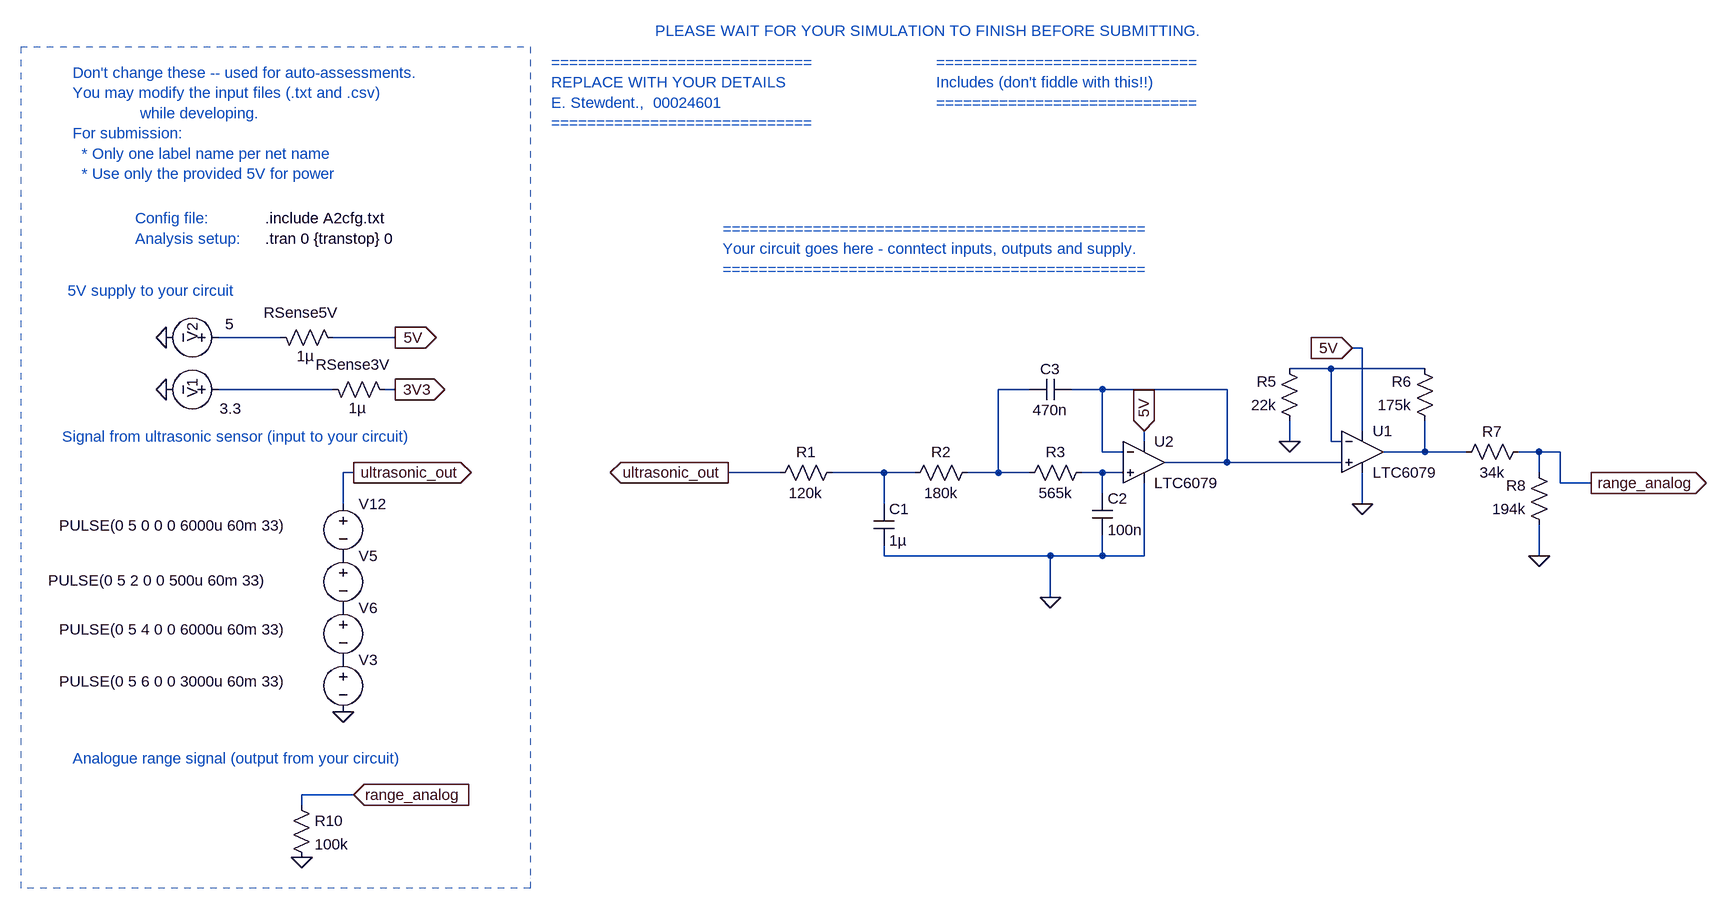
[diagram p0: schematic E344_Ass2_US2A.asc]
E344_Ass2_US2A.asc, the LTspice schematic file:
Version 4
SHEET 1 3140 2124
WIRE -1968 -976 -2064 -976
WIRE -1792 -976 -1888 -976
WIRE -304 -960 -320 -960
WIRE -352 -928 -416 -928
WIRE -208 -928 -352 -928
WIRE -1888 -896 -2064 -896
WIRE -1792 -896 -1808 -896
WIRE -816 -896 -864 -896
WIRE -704 -896 -752 -896
WIRE -512 -896 -704 -896
WIRE -304 -832 -304 -960
WIRE -640 -816 -640 -832
WIRE -416 -816 -416 -848
WIRE -352 -816 -352 -928
WIRE -336 -816 -352 -816
WIRE -704 -800 -704 -896
WIRE -672 -800 -704 -800
WIRE -208 -800 -208 -848
WIRE -208 -800 -272 -800
WIRE -144 -800 -208 -800
WIRE -32 -800 -64 -800
WIRE 0 -800 -32 -800
WIRE -512 -784 -512 -896
WIRE -512 -784 -608 -784
WIRE -336 -784 -512 -784
WIRE -1856 -768 -1872 -768
WIRE -1200 -768 -1280 -768
WIRE -1040 -768 -1120 -768
WIRE -992 -768 -1040 -768
WIRE -864 -768 -864 -896
WIRE -864 -768 -912 -768
WIRE -816 -768 -864 -768
WIRE -704 -768 -736 -768
WIRE -672 -768 -704 -768
WIRE -32 -768 -32 -800
WIRE 0 -752 0 -800
WIRE 48 -752 0 -752
WIRE -704 -736 -704 -768
WIRE -1872 -720 -1872 -768
WIRE -1040 -720 -1040 -768
WIRE -304 -720 -304 -768
WIRE -1040 -640 -1040 -656
WIRE -784 -640 -1040 -640
WIRE -704 -640 -704 -672
WIRE -704 -640 -784 -640
WIRE -640 -640 -640 -752
WIRE -640 -640 -704 -640
WIRE -32 -640 -32 -688
WIRE -784 -576 -784 -640
WIRE -1856 -272 -1936 -272
WIRE -1936 -256 -1936 -272
FLAG -1792 -976 5V
IOPIN -1792 -976 Out
FLAG -2144 -976 0
FLAG -1872 -400 0
FLAG -1856 -768 ultrasonic_out
IOPIN -1856 -768 Out
FLAG -1280 -768 ultrasonic_out
IOPIN -1280 -768 Out
FLAG 48 -752 range_analog
IOPIN 48 -752 Out
FLAG -1856 -272 range_analog
IOPIN -1856 -272 In
FLAG -1936 -176 0
FLAG -1792 -896 3V3
IOPIN -1792 -896 Out
FLAG -2144 -896 0
FLAG -320 -960 5V
IOPIN -320 -960 In
FLAG -416 -816 0
FLAG -784 -576 0
FLAG -640 -832 5V
IOPIN -640 -832 In
FLAG -304 -720 0
FLAG -32 -640 0
SYMBOL voltage -2048 -976 R90
WINDOW 123 0 0 Left 0
WINDOW 39 0 0 Left 0
WINDOW 0 -23 56 Left 2
WINDOW 3 -21 -8 VRight 2
SYMATTR InstName V2
SYMATTR Value 5
SYMBOL res -1984 -992 M90
WINDOW 0 -7 47 VBottom 2
WINDOW 3 29 54 VTop 2
SYMATTR InstName RSense5V
SYMATTR Value 1µ
SYMBOL voltage -1872 -736 R0
WINDOW 123 0 0 Left 0
WINDOW 39 0 0 Left 0
WINDOW 3 -437 49 Left 2
SYMATTR Value PULSE(0 5 0 0 0 6000u 60m 33)
SYMATTR InstName V12
SYMBOL voltage -1872 -656 R0
WINDOW 123 0 0 Left 0
WINDOW 39 0 0 Left 0
WINDOW 3 -454 54 Left 2
SYMATTR Value PULSE(0 5 2 0 0 500u 60m 33)
SYMATTR InstName V5
SYMBOL voltage -1872 -576 R0
WINDOW 123 0 0 Left 0
WINDOW 39 0 0 Left 0
WINDOW 3 -437 49 Left 2
SYMATTR Value PULSE(0 5 4 0 0 6000u 60m 33)
SYMATTR InstName V6
SYMBOL voltage -1872 -496 R0
WINDOW 123 0 0 Left 0
WINDOW 39 0 0 Left 0
WINDOW 3 -437 49 Left 2
SYMATTR Value PULSE(0 5 6 0 0 3000u 60m 33)
SYMATTR InstName V3
SYMBOL res -1952 -272 R0
SYMATTR InstName R10
SYMATTR Value 100k
SYMBOL voltage -2048 -896 R90
WINDOW 123 0 0 Left 0
WINDOW 39 0 0 Left 0
WINDOW 0 -17 56 Left 2
WINDOW 3 29 -20 VRight 2
SYMATTR InstName V1
SYMATTR Value 3.3
SYMBOL res -1904 -912 M90
WINDOW 0 -7 47 VBottom 2
WINDOW 3 29 54 VTop 2
SYMATTR InstName RSense3V
SYMATTR Value 1µ
SYMBOL Opamps\\LTC6079 -304 -800 R0
SYMATTR InstName U1
SYMBOL res -192 -832 R180
WINDOW 0 36 76 Left 2
WINDOW 3 36 40 Left 2
SYMATTR InstName R6
SYMATTR Value 175k
SYMBOL res -400 -832 R180
WINDOW 0 36 76 Left 2
WINDOW 3 36 40 Left 2
SYMATTR InstName R5
SYMATTR Value 22k
SYMBOL Opamps\\LTC6079 -640 -784 R0
SYMATTR InstName U2
SYMBOL res -1104 -784 R90
WINDOW 0 0 56 VBottom 2
WINDOW 3 32 56 VTop 2
SYMATTR InstName R1
SYMATTR Value 120k
SYMBOL res -896 -784 R90
WINDOW 0 0 56 VBottom 2
WINDOW 3 32 56 VTop 2
SYMATTR InstName R2
SYMATTR Value 180k
SYMBOL res -720 -784 R90
WINDOW 0 0 56 VBottom 2
WINDOW 3 32 56 VTop 2
SYMATTR InstName R3
SYMATTR Value 565k
SYMBOL cap -1056 -720 R0
SYMATTR InstName C1
SYMATTR Value 1µ
SYMBOL cap -720 -736 R0
SYMATTR InstName C2
SYMATTR Value 100n
SYMBOL cap -752 -912 R90
WINDOW 0 0 32 VBottom 2
WINDOW 3 32 32 VTop 2
SYMATTR InstName C3
SYMATTR Value 470n
SYMBOL res -48 -816 R90
WINDOW 0 0 56 VBottom 2
WINDOW 3 32 56 VTop 2
SYMATTR InstName R7
SYMATTR Value 34k
SYMBOL res -16 -672 R180
WINDOW 0 36 76 Left 2
WINDOW 3 36 40 Left 2
SYMATTR InstName R8
SYMATTR Value 194k
TEXT -1992 -1128 Left 2 !.tran 0 {transtop} 0
TEXT -1992 -1160 Left 2 !.include A2cfg.txt
TEXT -2288 -1384 Left 2 ;Don't change these -- used for auto-assessments.\nYou may modify the input files (.txt and .csv) \n               while developing.\nFor submission: \n  * Only one label name per net name\n  * Use only the provided 5V for power
TEXT -2192 -1160 Left 2 ;Config file:
TEXT -2192 -1128 Left 2 ;Analysis setup:
TEXT -1552 -1400 Left 2 ;=============================\nREPLACE WITH YOUR DETAILS\nE. Stewdent.,  00024601\n=============================
TEXT -960 -1400 Left 2 ;=============================\nIncludes (don't fiddle with this!!)\n=============================
TEXT -1288 -1144 Left 2 ;===============================================\nYour circuit goes here - conntect inputs, outputs and supply.\n===============================================
TEXT -1392 -1448 Left 2 ;PLEASE WAIT FOR YOUR SIMULATION TO FINISH BEFORE SUBMITTING.
TEXT -2304 -824 Left 2 ;Signal from ultrasonic sensor (input to your circuit)
TEXT -2296 -1048 Left 2 ;5V supply to your circuit
TEXT -2288 -328 Left 2 ;Analogue range signal (output from your circuit)
LINE Normal -1584 -1424 -1584 -128 2
LINE Normal -2368 -1424 -1584 -1424 2
LINE Normal -1584 -128 -2368 -128 2
LINE Normal -1584 -144 -1584 -144 2
LINE Normal -2368 -1424 -2368 -128 2

The netlist it stands for:
* E344_Ass2_US2A.asc
V2 N001 0 5
RSense5V N001 5V 1µ
V12 ultrasonic_out P001 PULSE(0 5 0 0 0 6000u 60m 33)
V5 P001 P002 PULSE(0 5 2 0 0 500u 60m 33)
V6 P002 P003 PULSE(0 5 4 0 0 6000u 60m 33)
V3 P003 0 PULSE(0 5 6 0 0 3000u 60m 33)
R10 range_analog 0 100k
V1 N003 0 3.3
RSense3V N003 3V3 1µ
XU1 N005 N002 5V 0 N006 LTC6078  ; LTC6079, pins In+ In- V+ V- OUT
R6 N006 N002 175k
R5 0 N002 22k
XU2 N008 N005 5V 0 N005 LTC6078  ; LTC6079, pins In+ In- V+ V- OUT
R1 N007 ultrasonic_out 120k
R2 N004 N007 180k
R3 N008 N004 565k
C1 N007 0 1µ
C2 N008 0 100n
C3 N005 N004 470n
R7 range_analog N006 34k
R8 0 range_analog 194k
.tran 0 {transtop} 0
.include A2cfg.txt
* Don't change these -- used for auto-assessments.
* You may modify the input files (.txt and .csv)
*                while developing.
* For submission:
*   * Only one label name per net name
*   * Use only the provided 5V for power
* Config file:
* Analysis setup:
* =============================
* REPLACE WITH YOUR DETAILS
* E. Stewdent.,  00024601
* =============================
* =============================
* Includes (don't fiddle with this!!)
* =============================
* ===============================================
* Your circuit goes here - conntect inputs, outputs and supply.
* ===============================================
* PLEASE WAIT FOR YOUR SIMULATION TO FINISH BEFORE SUBMITTING.
* Signal from ultrasonic sensor (input to your circuit)
* 5V supply to your circuit
* Analogue range signal (output from your circuit)
.lib LTC5.lib
.backanno
.end